# EAGLE design spaceloop_sensor (EAGLE 7.6.0)
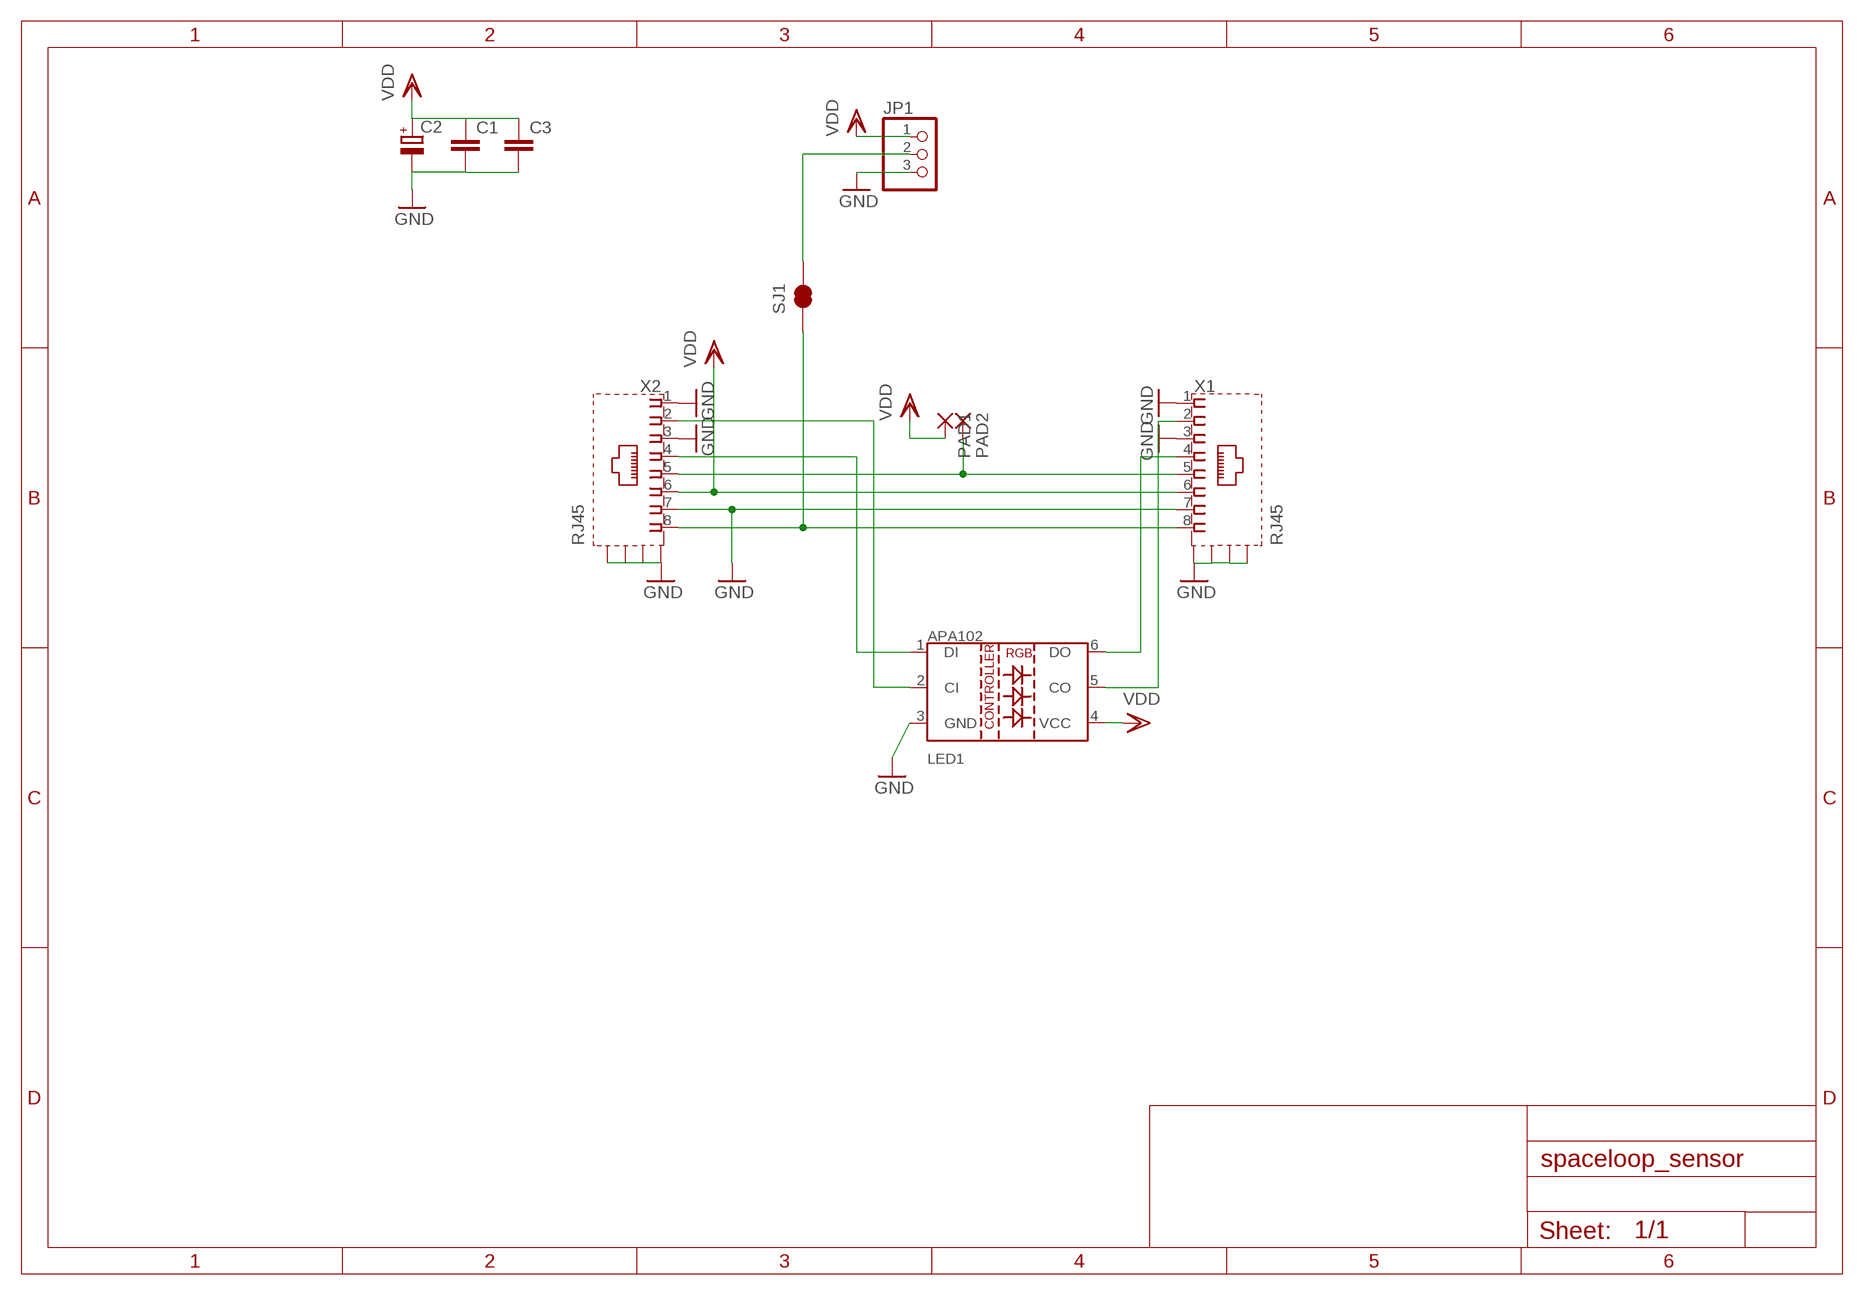
[diagram p0: schematic, sheet 1]

## Parts
C1  C-EUC0805K  [C0805K]
C2  CPOL-EU150CLZ-0810  [150CLZ-0810]
C3  C-EUC0805K  [C0805K]
JP1  PINHD-1X3  [1X03]
LED1  LED-APA102  [LED-APA102]
PAD1  SMD5  [SMD2,54-5,08]
PAD2  SMD5  [SMD2,54-5,08]
SJ1  JUMPER-PAD-2-NC_BY_TRACENO_SILK  [PAD-JUMPER-2-NC_BY_TRACE_NO_SILK]
X1  RJ45  RJ45-6L2-B  [RJ45-SHIELD2]
X2  RJ45  RJ45-6L2-B  [RJ45-SHIELD2]

## Nets
GND: C1.2 C2.- C3.2 JP1.3 LED1.3(GND) X1.1 X1.3 X1.7 X1.S1(S) X1.S2(S) X1.S3(S) X1.S4(S) X2.1 X2.3 X2.7 X2.S1(S) X2.S2(S) X2.S3(S) X2.S4(S)
N$1: LED1.6(DO) X1.4
N$2: SJ1.1 X1.8 X2.8
N$3: LED1.5(CO) X1.2
N$4: LED1.2(CI) X2.2
N$5: LED1.1(DI) X2.4
N$6: PAD2.1(P) X1.5 X2.5
N$7: JP1.2 SJ1.2
VDD: C1.1 C2.+ C3.1 JP1.1 LED1.4(VCC) PAD1.1(P) X1.6 X2.6

## Library data of the parts
C1 C3 = rcl:C-EU: CAPACITOR, European symbol
C2 = rcl:CPOL-EU: POLARIZED CAPACITOR, European symbol
JP1 = pinhead:PINHD-1X3: PIN HEADER
LED1 = Ai_LED:LED-APA102
PAD1 PAD2 = wirepad:SMD5: SMD PAD
SJ1 = SparkFun-Passives:JUMPER-PAD-2-NC_BY_TRACE
X1 X2 = con-tycoelectronics:RJ45*2: RJ45 Low Profile Shield Type 2 For all RJ45 L, LC, LCT and X Series Models Source: www.tycoelectronics.com .. ENG_DS_1654001_1099_RJ_L_0507.pdf; MPN: RJ45-6L2-B; OC_FARNELL: unknown; OC_NEWARK: 16R6096

## Board
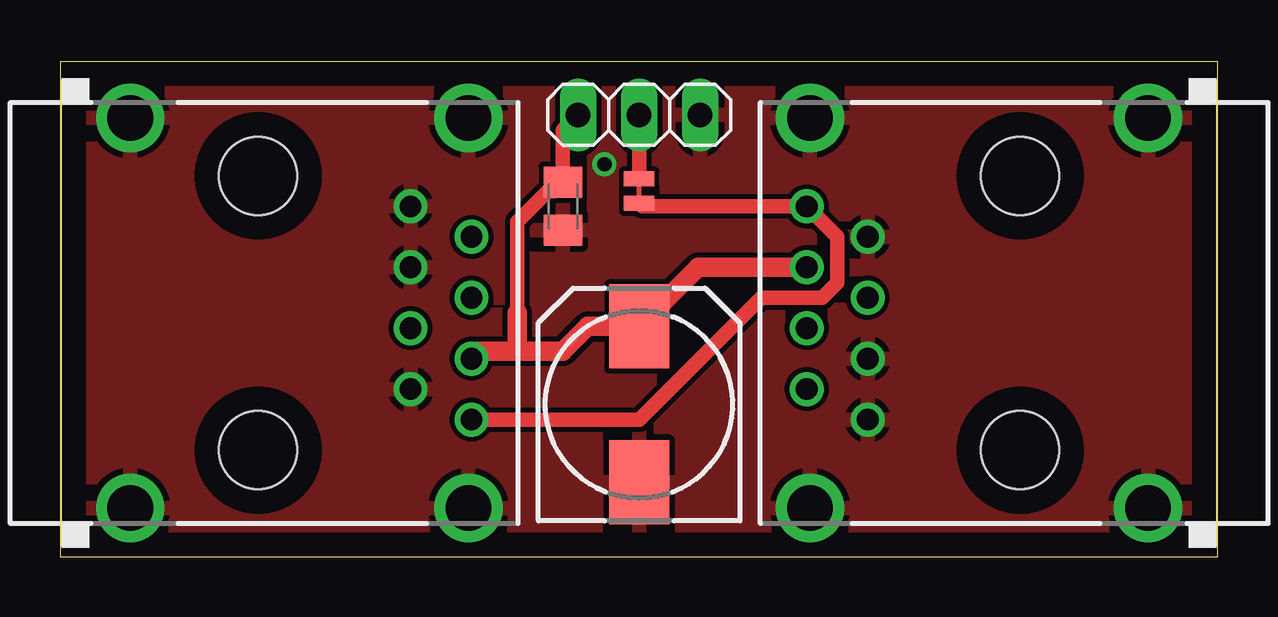
[diagram p1: board, top side]
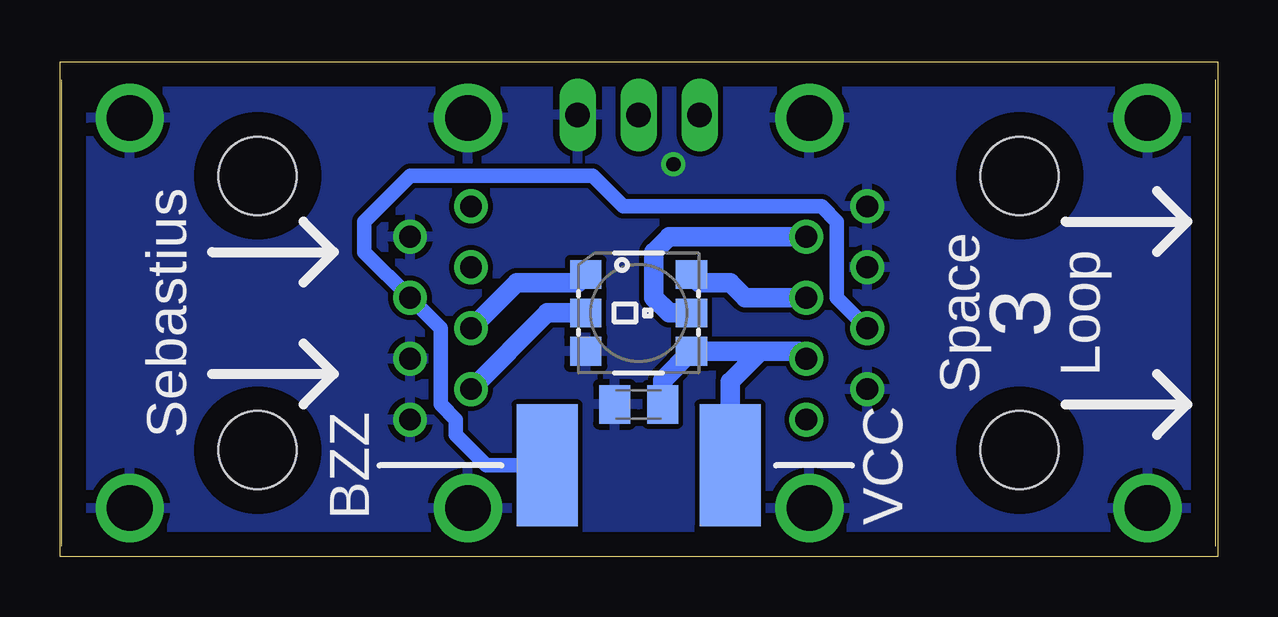
[diagram p2: board, bottom side, seen from below]

Size 48.24 x 20.62 mm. Coordinates in mm from the lower left corner, seen from the top.
Outline: 0,0 48.24,0 48.24,20.62 0,20.62 0,0
Copper layers (1*16): Top 0.035mm / dielectric 1.5mm / Bottom 0.035mm
Design rules "default": minimum track width 10mil, minimum drill 24mil, track to track 8mil, track to pad 8mil, pad to pad 8mil, via to via 8mil, smd to smd 8mil, copper to edge 40mil, drill to drill 8mil, minimum pad ring 10mil, minimum via ring 8mil, stop-mask expansion 4mil, vias tented up to drill 0mil, thermal gap 10mil

### Footprints (pad centres in the part's own frame; a part is rotated, then mirrored left to right if it is on the bottom)
C0805K = smd 1.3 x 1.6: 1 -1,0; 2 1,0
150CLZ-0810 = smd 3.5 x 2.5: + 3.25,0; - -3.25,0
1X03 = drill 1.016 long: 1 -2.54,0; 2 0,0; 3 2.54,0
LED-APA102 = smd 1.3 x 1.2: 1 -2.2,1.6; 2 -2.2,0; 3 -2.2,-1.6; 4 2.2,-1.6; 5 2.2,0; 6 2.2,1.6
SMD2,54-5,08 = smd 2.54 x 5.08: 1 0,0
PAD-JUMPER-2-NC_BY_TRACE_NO_SILK = smd 0.635 x 1.27: 1 -0.508,0; 2 0.508,0
RJ45-SHIELD2 = drill 0.9 pad 1.4: 1 -4.445,6.35; 2 -3.175,8.89; 3 -1.905,6.35; 4 -0.635,8.89; 5 0.635,6.35; 6 1.905,8.89; 7 3.175,6.35; 8 4.445,8.89 | drill 1.9 pad 2.5: S1 -8.128,-5.33; S2 8.128,-5.33; S3 -8.128,8.76; S4 8.128,8.76 | hole 3.251: -5.715,0; 5.715,0

### Placement (x,y rotation side)
C1  20.95,14.61 270 top
C2  24.13,6.35 90 top
C3  24.13,6.35 180 bottom
JP1  24.13,18.41 0 top
LED1  24.13,10.16 0 bottom
PAD1  20.32,3.81 180 bottom
PAD2  27.94,3.81 180 bottom
SJ1  24.13,15.24 90 top
X1  8.26,10.16 270 top
X2  40.01,10.16 90 top

### Tracks (layer width: path | path; a pad name or v marks a point on that pad's centre or on a via)
GND  (via drill 0.6)
  other vias: 22.68,16.36
  pour Bottom: 0,20.32 0,0 50.8,0 50.8,20.32
  pour Top: 0,20.32 0,0 50.8,0 50.8,20.32
N$1
  Bottom 0.813: X1.4 19.68,10.79 20.32,11.43 21.6,11.43 LED1.6
N$2
  Top 0.61: X1.8 24.13,5.71 29.21,10.79 31.75,10.79 32.38,11.43 32.38,13.34 X2.8 24.26,14.61 SJ1.1
N$3
  Bottom 0.813: LED1.5 22.86,10.16 23.5,10.79 23.5,12.7 22.86,13.34 X1.2
N$4
  Bottom 0.813: LED1.2 27.94,10.16 X2.2
N$5
  Bottom 0.813: X2.4 29.21,11.43 26.66,11.43 LED1.1
N$6
  Bottom 0.61: X1.5 15.88,10.79 15.88,13.97 16.51,14.61 24.77,14.61 26.04,15.88 33.66,15.88 35.56,13.97 35.56,12.7 X2.5 32.38,9.53 32.38,6.35 31.75,5.71 31.75,5.08 30.48,3.81 PAD2.1
N$7
  Top 0.61: SJ1.2 JP1.2
VDD
  Top 0.61: JP1.1 20.95,17.78 C1.1 20.59,15.24 20.32,15.24 19.05,13.97 19.05,10.16
  Top 0.813: X2.6 26.59,12.06 C2.+ 22,9.6 20.95,8.56 19.05,8.56 | 19.05,8.56 17.45,8.56 X1.6 | 19.05,10.16 19.05,8.56
  Bottom 0.813: 19.05,8.56 LED1.4 23.13,7.36 C3.1 | 19.05,8.56 17.45,8.56 X1.6 | PAD1.1 20.32,7.29 19.05,8.56

### Text on the board
bPlace: 3 | Space / / Loop | Sebastius
bNames: VCC | BZZ